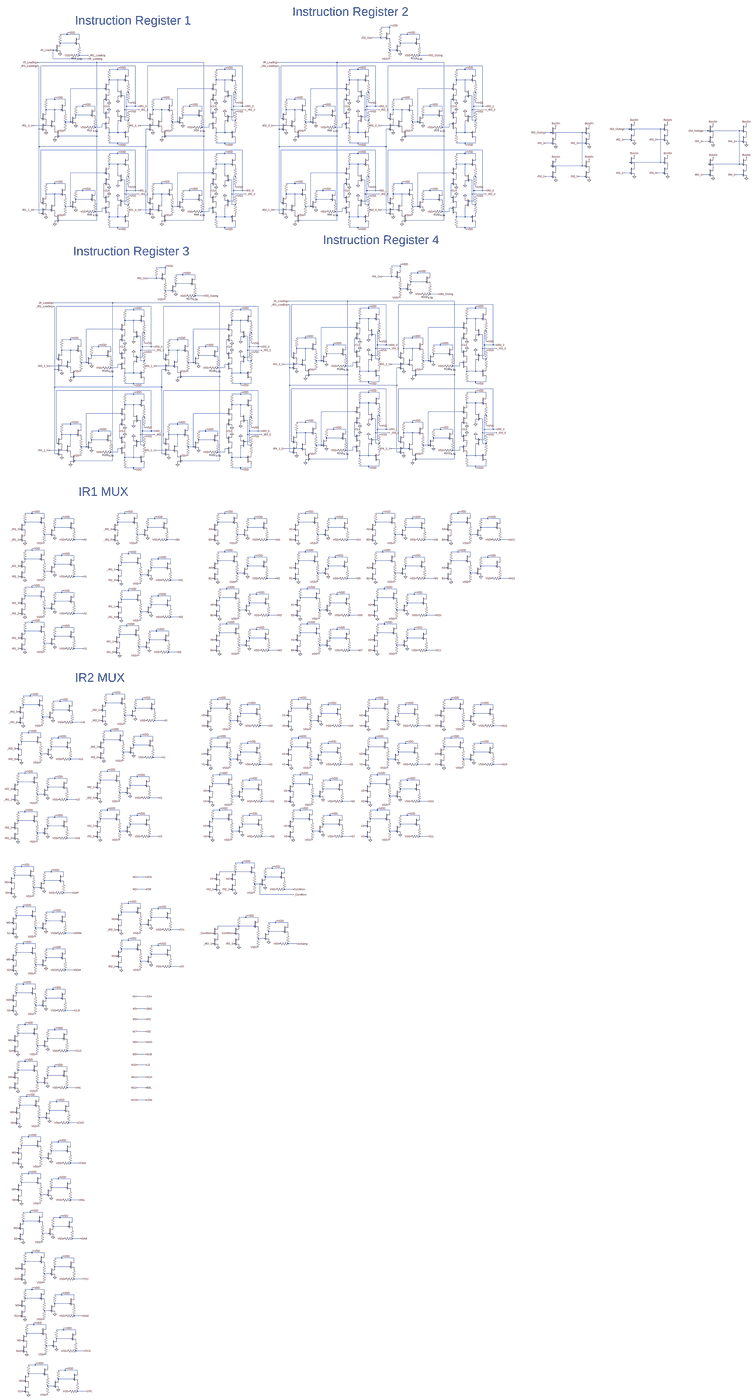
[diagram p0: schematic instruction_register.asc, whole sheet]
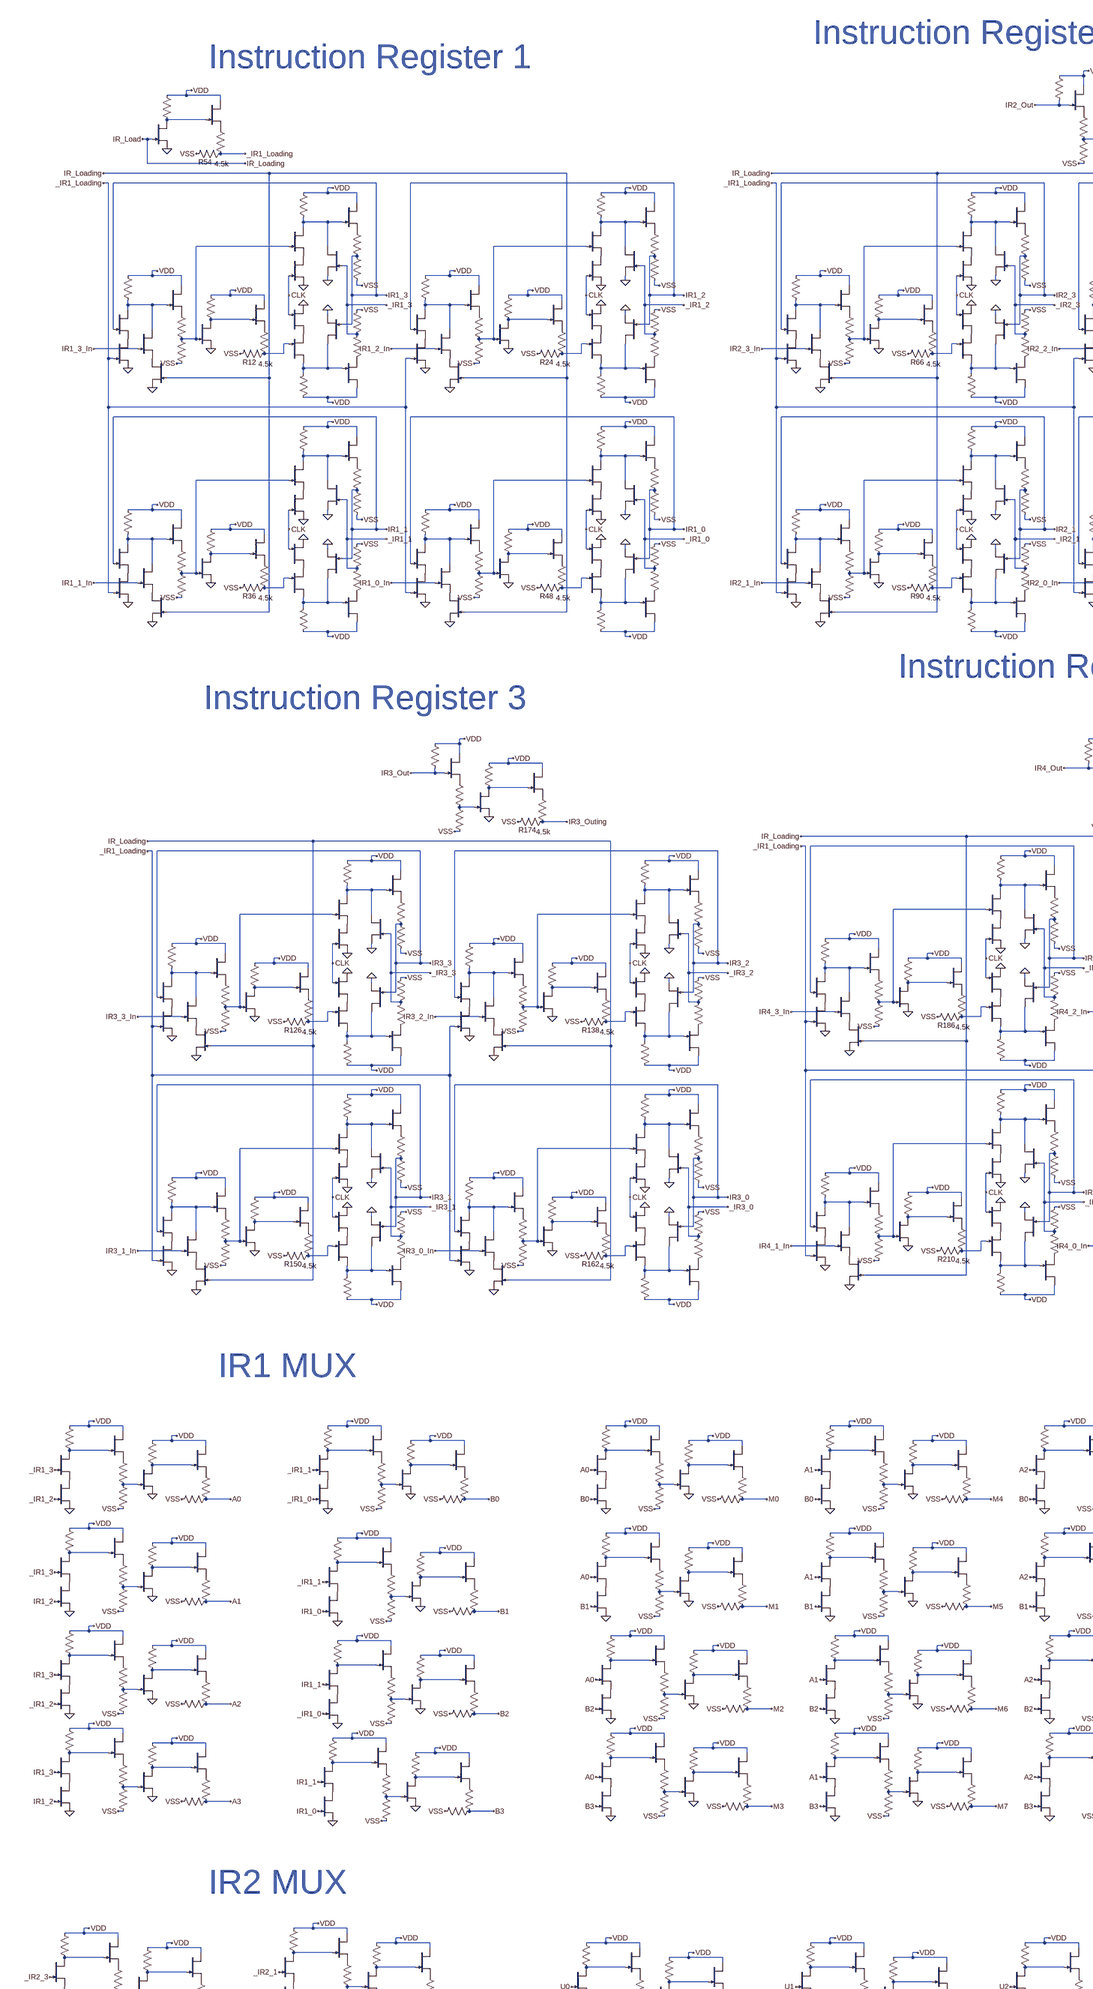
[diagram p1: schematic instruction_register.asc, part, row 1 of 2, column 1 of 2]
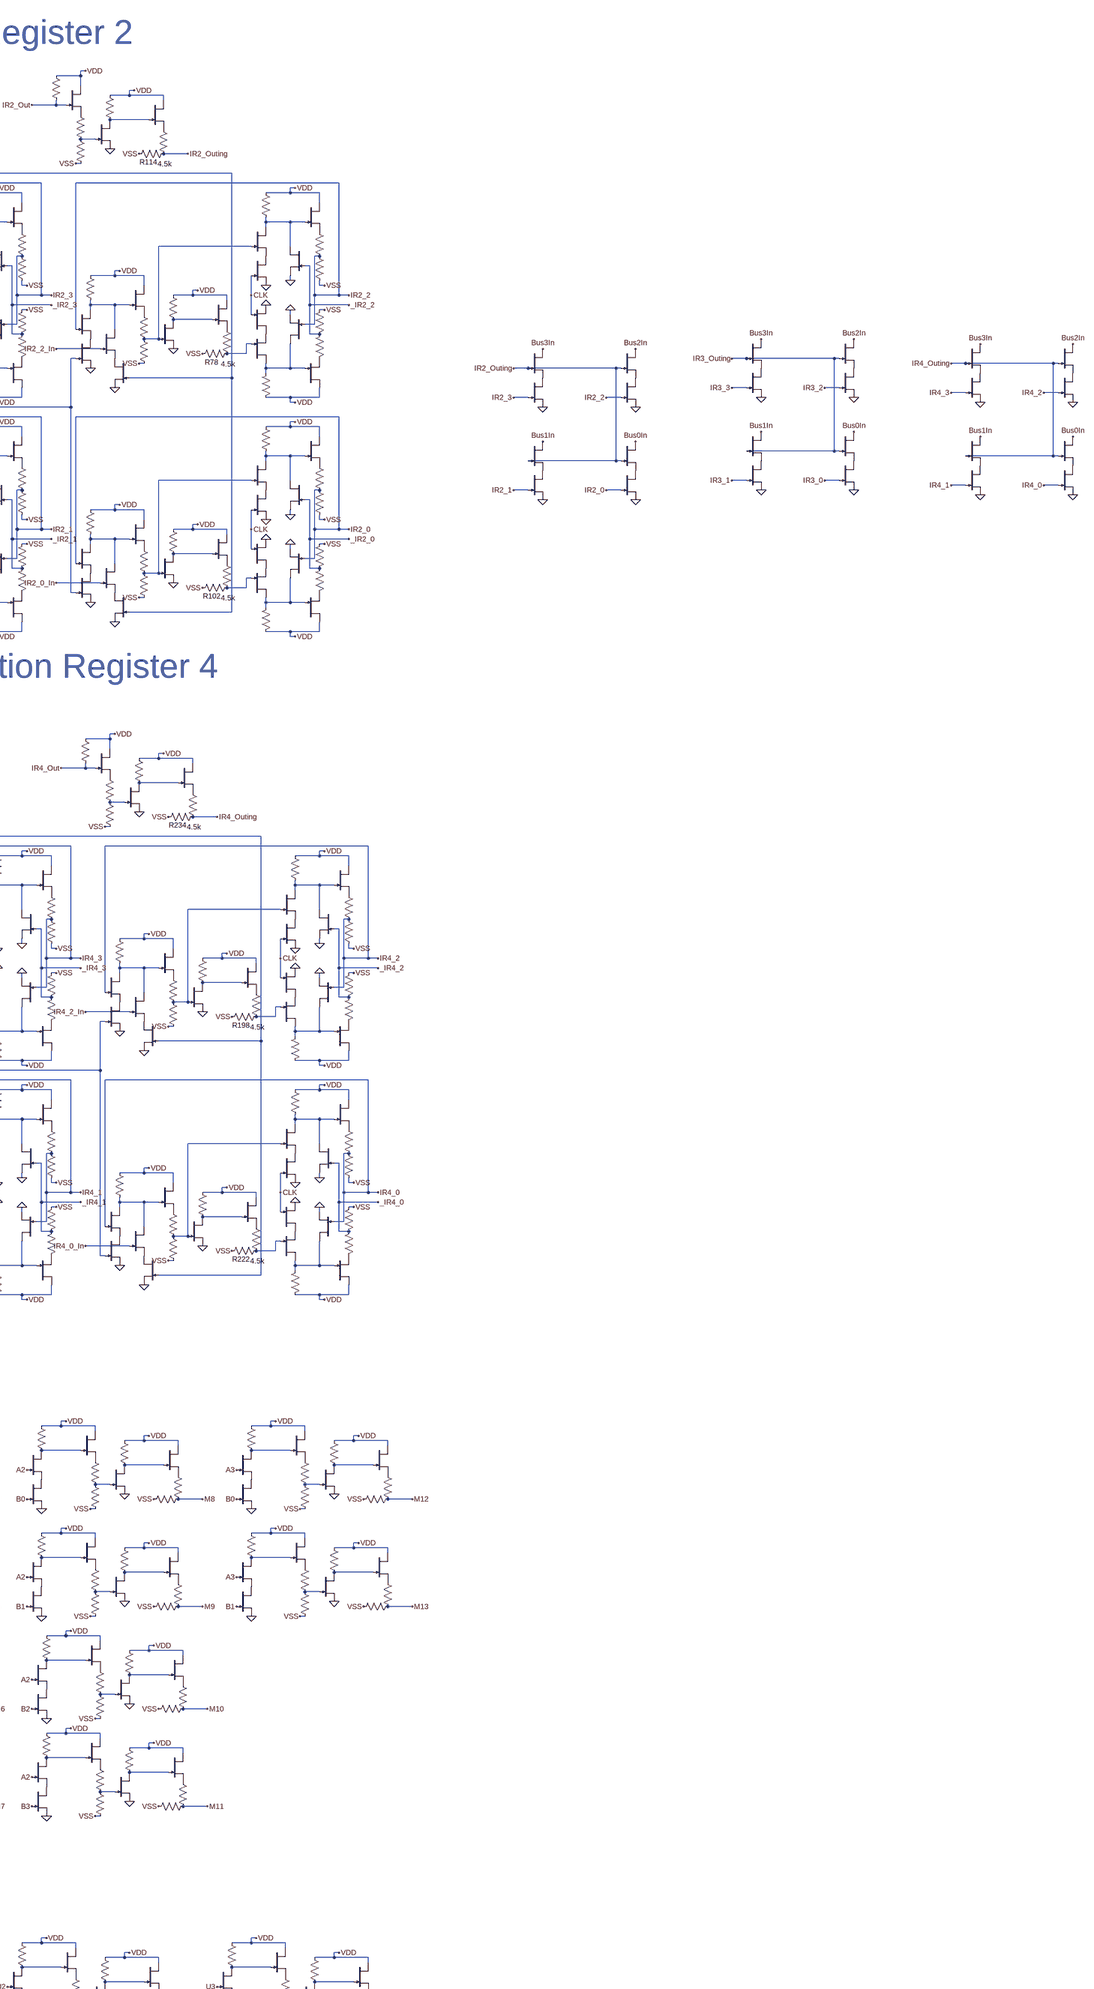
[diagram p2: schematic instruction_register.asc, part, row 1 of 2, column 2 of 2]
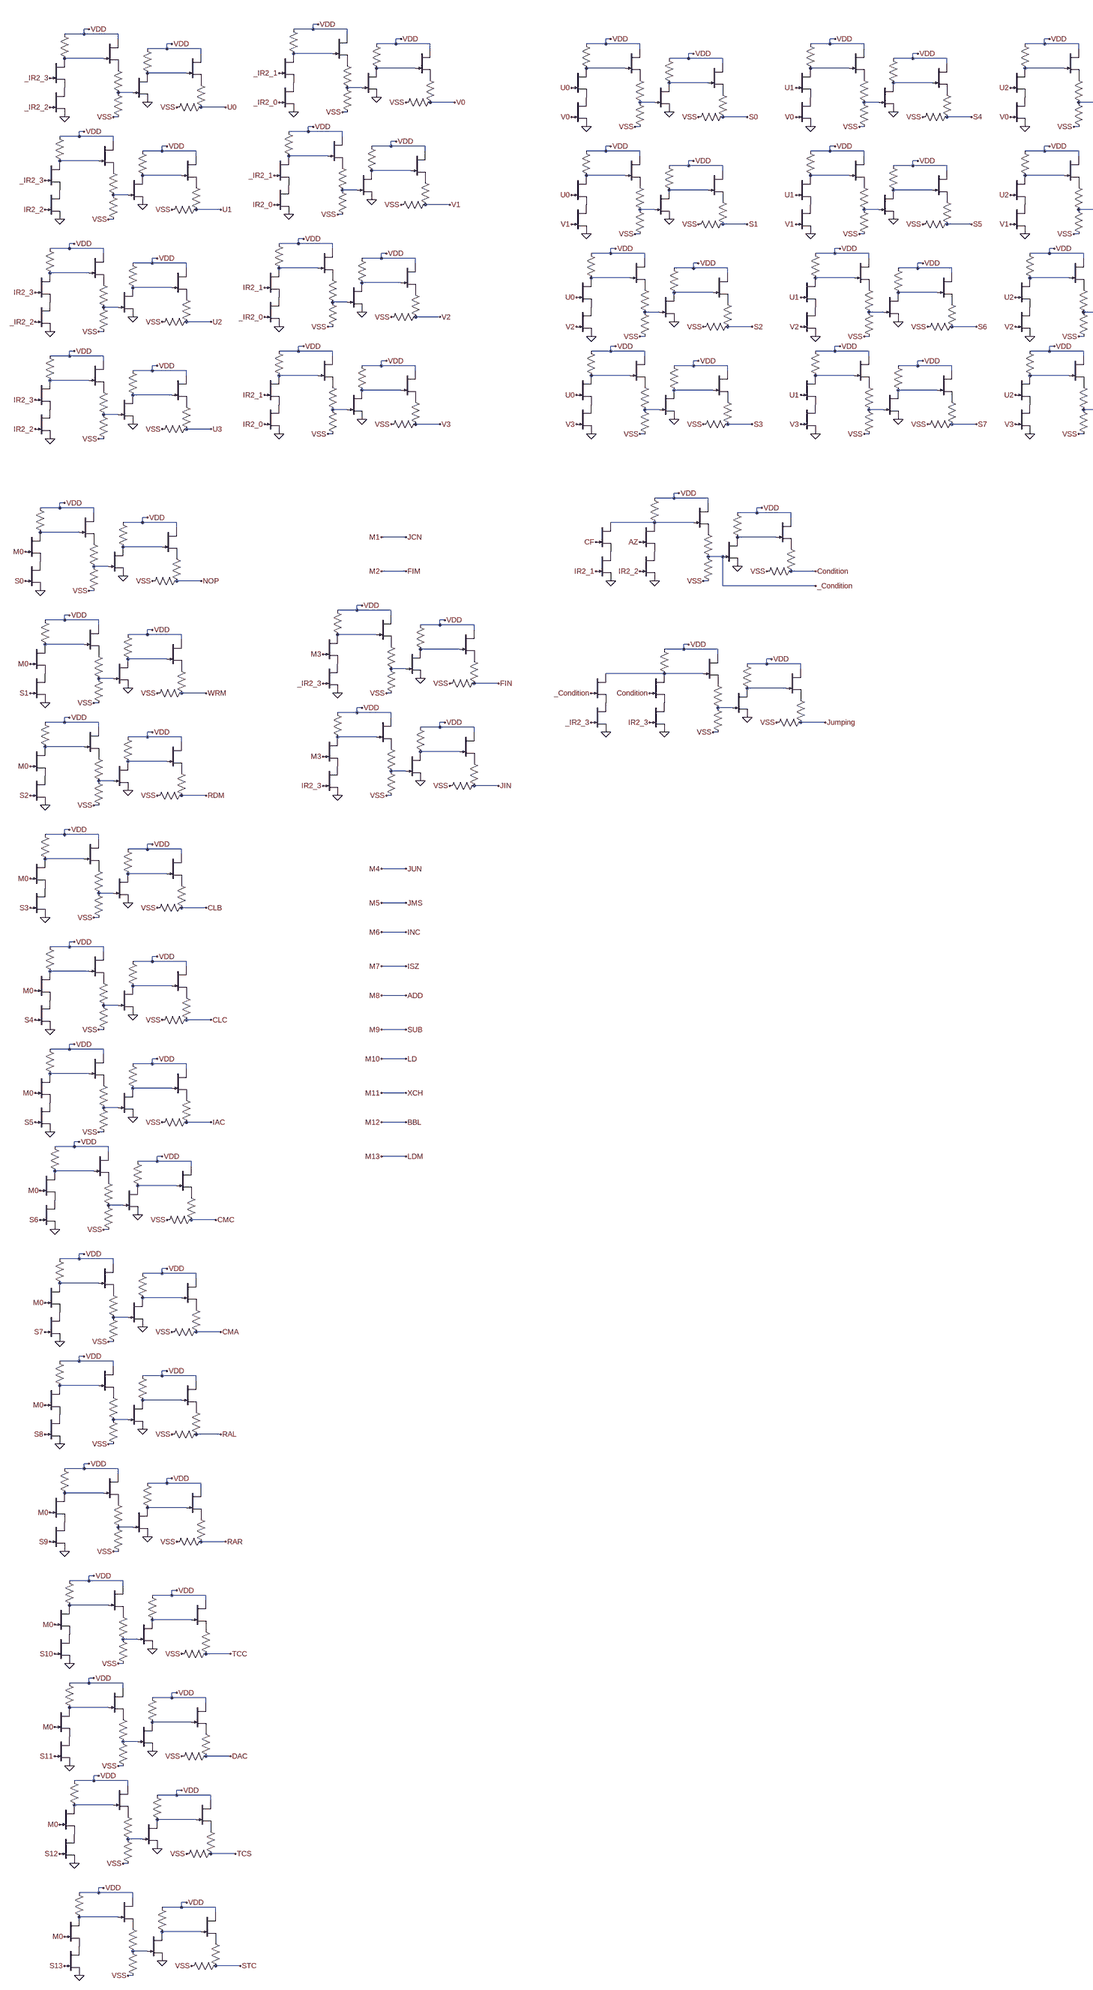
[diagram p3: schematic instruction_register.asc, part, row 2 of 2, column 1 of 2]
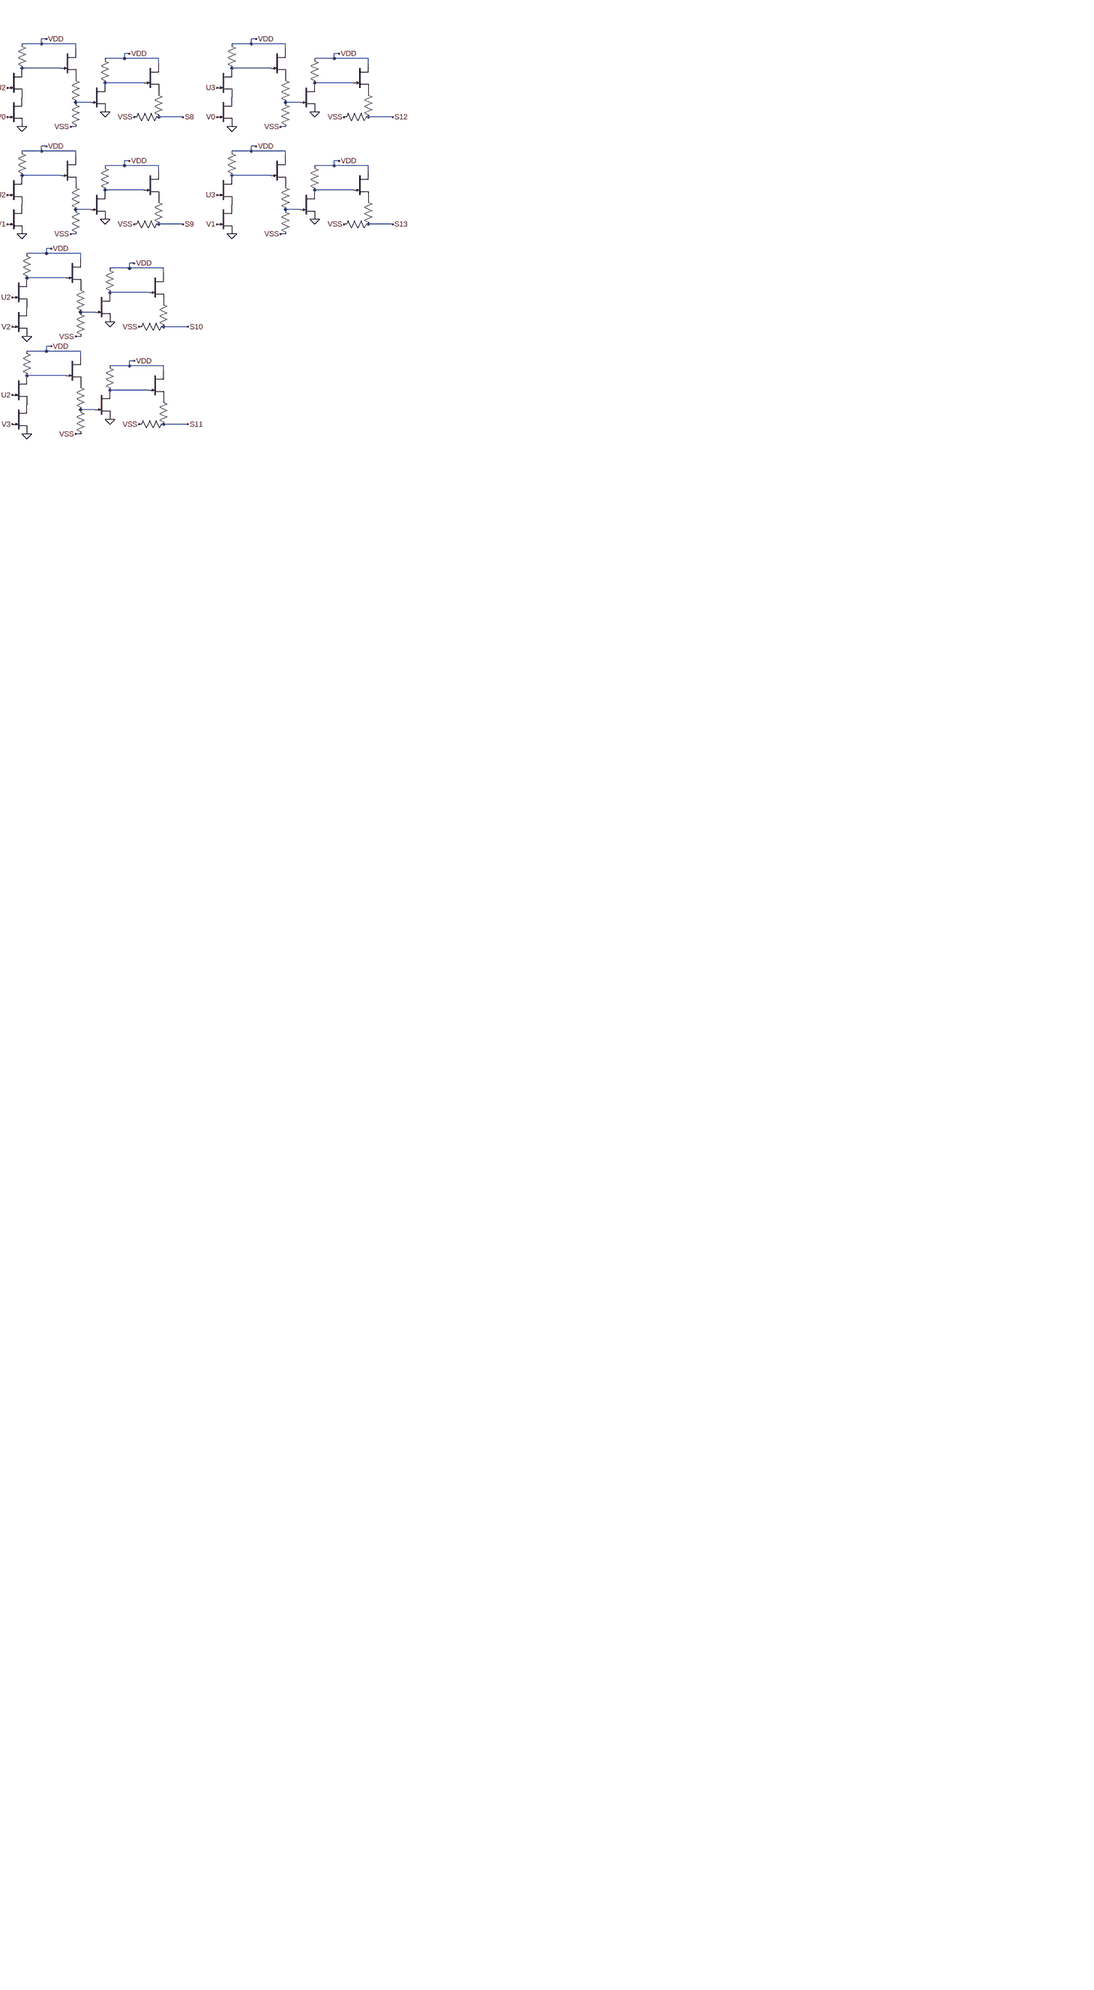
[diagram p4: schematic instruction_register.asc, part, row 2 of 2, column 2 of 2]
* instruction_register.asc
J_A1 P001 IR2_3 0 DR
J_A2 Bus3In IR2_Outing P001 DR
J_A3 P002 IR2_2 0 DR
J_A4 Bus2In IR2_Outing P002 DR
J_A5 P003 IR2_1 0 DR
J_A6 Bus1In IR2_Outing P003 DR
J_A7 P004 IR2_0 0 DR
J_A8 Bus0In IR2_Outing P004 DR
J_A9 P005 IR3_3 0 DR
J_A10 Bus3In IR3_Outing P005 DR
J_A11 P006 IR3_2 0 DR
J_A12 Bus2In IR3_Outing P006 DR
J_A13 P007 IR3_1 0 DR
J_A14 Bus1In IR3_Outing P007 DR
J_A15 P008 IR3_0 0 DR
J_A16 Bus0In IR3_Outing P008 DR
J_A17 P009 IR4_3 0 DR
J_A18 Bus3In IR4_Outing P009 DR
J_A19 P010 IR4_2 0 DR
J_A20 Bus2In IR4_Outing P010 DR
J_A21 P011 IR4_1 0 DR
J_A22 Bus1In IR4_Outing P011 DR
J_A23 P012 IR4_0 0 DR
J_A24 Bus0In IR4_Outing P012 DR
J_A25 N004 N008 P013 DR
R1 VDD N004 100k
J_F1 VDD N004 P014 DR
R2 P014 IR1_3 1k
R3 IR1_3 VSS 4.8k
J_B1 N004 _IR1_3 0 DR
J_A26 N024 N020 P015 DR
R4 VDD N024 100k
J_F2 VDD N024 P016 DR
R5 P016 _IR1_3 1k
R6 _IR1_3 VSS 4.8k
J_B2 N024 IR1_3 0 DR
J_A27 P013 CLK 0 DR
J_A28 P015 CLK 0 DR
J_A29 N012 IR1_3 P017 DR
R7 VDD N012 100k
J_F3 VDD N012 P018 DR
R8 P018 N008 1k
R9 N008 VSS 4.8k
J_B3 N012 IR1_3_In P019 DR
J_A30 N016 N008 0 DR
R10 VDD N016 50k
J_A31 VDD N016 P020 DR
R11 P020 N020 1k
R12 N020 VSS 4.5k
J_A32 P017 _IR1_Loading 0 DR
J_B4 P019 IR_Loading 0 DR
J_A33 N005 N009 P021 DR
R13 VDD N005 100k
J_F4 VDD N005 P022 DR
R14 P022 IR1_2 1k
R15 IR1_2 VSS 4.8k
J_B5 N005 _IR1_2 0 DR
J_A34 N025 N021 P023 DR
R16 VDD N025 100k
J_F5 VDD N025 P024 DR
R17 P024 _IR1_2 1k
R18 _IR1_2 VSS 4.8k
J_B6 N025 IR1_2 0 DR
J_A35 P021 CLK 0 DR
J_A36 P023 CLK 0 DR
J_A37 N013 IR1_2 P025 DR
R19 VDD N013 100k
J_F6 VDD N013 P026 DR
R20 P026 N009 1k
R21 N009 VSS 4.8k
J_B7 N013 IR1_2_In P027 DR
J_A38 N017 N009 0 DR
R22 VDD N017 50k
J_A39 VDD N017 P028 DR
R23 P028 N021 1k
R24 N021 VSS 4.5k
J_A40 P025 _IR1_Loading 0 DR
J_B8 P027 IR_Loading 0 DR
J_A41 N028 N032 P029 DR
R25 VDD N028 100k
J_F7 VDD N028 P030 DR
R26 P030 IR1_1 1k
R27 IR1_1 VSS 4.8k
J_B9 N028 _IR1_1 0 DR
J_A42 N048 N044 P031 DR
R28 VDD N048 100k
J_F8 VDD N048 P032 DR
R29 P032 _IR1_1 1k
R30 _IR1_1 VSS 4.8k
J_B10 N048 IR1_1 0 DR
J_A43 P029 CLK 0 DR
J_A44 P031 CLK 0 DR
J_A45 N036 IR1_1 P033 DR
R31 VDD N036 100k
J_F9 VDD N036 P034 DR
R32 P034 N032 1k
R33 N032 VSS 4.8k
J_B11 N036 IR1_1_In P035 DR
J_A46 N040 N032 0 DR
R34 VDD N040 50k
J_A47 VDD N040 P036 DR
R35 P036 N044 1k
R36 N044 VSS 4.5k
J_A48 P033 _IR1_Loading 0 DR
J_B12 P035 IR_Loading 0 DR
J_A49 N029 N033 P037 DR
R37 VDD N029 100k
J_F10 VDD N029 P038 DR
R38 P038 IR1_0 1k
R39 IR1_0 VSS 4.8k
J_B13 N029 _IR1_0 0 DR
J_A50 N049 N045 P039 DR
R40 VDD N049 100k
J_F11 VDD N049 P040 DR
R41 P040 _IR1_0 1k
R42 _IR1_0 VSS 4.8k
J_B14 N049 IR1_0 0 DR
J_A51 P037 CLK 0 DR
J_A52 P039 CLK 0 DR
J_A53 N037 IR1_0 P041 DR
R43 VDD N037 100k
J_F12 VDD N037 P042 DR
R44 P042 N033 1k
R45 N033 VSS 4.8k
J_B15 N037 IR1_0_In P043 DR
J_A54 N041 N033 0 DR
R46 VDD N041 50k
J_A55 VDD N041 P044 DR
R47 P044 N045 1k
R48 N045 VSS 4.5k
J_A56 P041 _IR1_Loading 0 DR
J_B16 P043 IR_Loading 0 DR
J_A57 N001 IR_Loading 0 DR
R52 VDD N001 50k
J_A58 VDD N001 P045 DR
R53 P045 _IR1_Loading 1k
R54 _IR1_Loading VSS 4.5k
J_A59 N006 N010 P046 DR
R55 VDD N006 100k
J_F14 VDD N006 P047 DR
R56 P047 IR2_3 1k
R57 IR2_3 VSS 4.8k
J_B17 N006 _IR2_3 0 DR
J_A60 N026 N022 P048 DR
R58 VDD N026 100k
J_F15 VDD N026 P049 DR
R59 P049 _IR2_3 1k
R60 _IR2_3 VSS 4.8k
J_B18 N026 IR2_3 0 DR
J_A61 P046 CLK 0 DR
J_A62 P048 CLK 0 DR
J_A63 N014 IR2_3 P050 DR
R61 VDD N014 100k
J_F16 VDD N014 P051 DR
R62 P051 N010 1k
R63 N010 VSS 4.8k
J_B19 N014 IR2_3_In P052 DR
J_A64 N018 N010 0 DR
R64 VDD N018 50k
J_A65 VDD N018 P053 DR
R65 P053 N022 1k
R66 N022 VSS 4.5k
J_A66 P050 _IR1_Loading 0 DR
J_B20 P052 IR_Loading 0 DR
J_A67 N007 N011 P054 DR
R67 VDD N007 100k
J_F17 VDD N007 P055 DR
R68 P055 IR2_2 1k
R69 IR2_2 VSS 4.8k
J_B21 N007 _IR2_2 0 DR
J_A68 N027 N023 P056 DR
R70 VDD N027 100k
J_F18 VDD N027 P057 DR
R71 P057 _IR2_2 1k
R72 _IR2_2 VSS 4.8k
J_B22 N027 IR2_2 0 DR
J_A69 P054 CLK 0 DR
J_A70 P056 CLK 0 DR
J_A71 N015 IR2_2 P058 DR
R73 VDD N015 100k
J_F19 VDD N015 P059 DR
R74 P059 N011 1k
R75 N011 VSS 4.8k
J_B23 N015 IR2_2_In P060 DR
J_A72 N019 N011 0 DR
R76 VDD N019 50k
J_A73 VDD N019 P061 DR
R77 P061 N023 1k
R78 N023 VSS 4.5k
J_A74 P058 _IR1_Loading 0 DR
J_B24 P060 IR_Loading 0 DR
J_A75 N030 N034 P062 DR
R79 VDD N030 100k
J_F20 VDD N030 P063 DR
R80 P063 IR2_1 1k
R81 IR2_1 VSS 4.8k
J_B25 N030 _IR2_1 0 DR
J_A76 N050 N046 P064 DR
R82 VDD N050 100k
J_F21 VDD N050 P065 DR
R83 P065 _IR2_1 1k
R84 _IR2_1 VSS 4.8k
J_B26 N050 IR2_1 0 DR
J_A77 P062 CLK 0 DR
J_A78 P064 CLK 0 DR
J_A79 N038 IR2_1 P066 DR
R85 VDD N038 100k
J_F22 VDD N038 P067 DR
R86 P067 N034 1k
R87 N034 VSS 4.8k
J_B27 N038 IR2_1_In P068 DR
J_A80 N042 N034 0 DR
R88 VDD N042 50k
J_A81 VDD N042 P069 DR
R89 P069 N046 1k
R90 N046 VSS 4.5k
J_A82 P066 _IR1_Loading 0 DR
J_B28 P068 IR_Loading 0 DR
J_A83 N031 N035 P070 DR
R91 VDD N031 100k
J_F23 VDD N031 P071 DR
R92 P071 IR2_0 1k
R93 IR2_0 VSS 4.8k
J_B29 N031 _IR2_0 0 DR
J_A84 N051 N047 P072 DR
R94 VDD N051 100k
J_F24 VDD N051 P073 DR
R95 P073 _IR2_0 1k
R96 _IR2_0 VSS 4.8k
J_B30 N051 IR2_0 0 DR
J_A85 P070 CLK 0 DR
J_A86 P072 CLK 0 DR
J_A87 N039 IR2_0 P074 DR
R97 VDD N039 100k
J_F25 VDD N039 P075 DR
R98 P075 N035 1k
R99 N035 VSS 4.8k
J_B31 N039 IR2_0_In P076 DR
J_A88 N043 N035 0 DR
R100 VDD N043 50k
J_A89 VDD N043 P077 DR
R101 P077 N047 1k
R102 N047 VSS 4.5k
J_A90 P074 _IR1_Loading 0 DR
J_B32 P076 IR_Loading 0 DR
R109 VDD IR2_Out 100k
J_F27 VDD IR2_Out P078 DR
R110 P078 N003 1k
R111 N003 VSS 4.8k
J_A93 N002 N003 0 DR
R112 VDD N002 50k
J_A94 VDD N002 P079 DR
R113 P079 IR2_Outing 1k
R114 IR2_Outing VSS 4.5k
J_A95 N058 N062 P080 DR
R115 VDD N058 100k
J_F28 VDD N058 P081 DR
R116 P081 IR3_3 1k
R117 IR3_3 VSS 4.8k
J_B33 N058 _IR3_3 0 DR
J_A96 N078 N074 P082 DR
R118 VDD N078 100k
J_F29 VDD N078 P083 DR
R119 P083 _IR3_3 1k
R120 _IR3_3 VSS 4.8k
J_B34 N078 IR3_3 0 DR
J_A97 P080 CLK 0 DR
J_A98 P082 CLK 0 DR
J_A99 N066 IR3_3 P084 DR
R121 VDD N066 100k
J_F30 VDD N066 P085 DR
R122 P085 N062 1k
R123 N062 VSS 4.8k
J_B35 N066 IR3_3_In P086 DR
J_A100 N070 N062 0 DR
R124 VDD N070 50k
J_A101 VDD N070 P087 DR
R125 P087 N074 1k
R126 N074 VSS 4.5k
J_A102 P084 _IR1_Loading 0 DR
J_B36 P086 IR_Loading 0 DR
J_A103 N059 N063 P088 DR
R127 VDD N059 100k
J_F31 VDD N059 P089 DR
R128 P089 IR3_2 1k
R129 IR3_2 VSS 4.8k
J_B37 N059 _IR3_2 0 DR
J_A104 N079 N075 P090 DR
R130 VDD N079 100k
J_F32 VDD N079 P091 DR
R131 P091 _IR3_2 1k
R132 _IR3_2 VSS 4.8k
J_B38 N079 IR3_2 0 DR
J_A105 P088 CLK 0 DR
J_A106 P090 CLK 0 DR
J_A107 N067 IR3_2 P092 DR
R133 VDD N067 100k
J_F33 VDD N067 P093 DR
R134 P093 N063 1k
R135 N063 VSS 4.8k
J_B39 N067 IR3_2_In P094 DR
J_A108 N071 N063 0 DR
R136 VDD N071 50k
J_A109 VDD N071 P095 DR
R137 P095 N075 1k
R138 N075 VSS 4.5k
J_A110 P092 _IR1_Loading 0 DR
J_B40 P094 IR_Loading 0 DR
J_A111 N082 N086 P096 DR
R139 VDD N082 100k
J_F34 VDD N082 P097 DR
R140 P097 IR3_1 1k
R141 IR3_1 VSS 4.8k
J_B41 N082 _IR3_1 0 DR
J_A112 N102 N098 P098 DR
R142 VDD N102 100k
J_F35 VDD N102 P099 DR
R143 P099 _IR3_1 1k
R144 _IR3_1 VSS 4.8k
J_B42 N102 IR3_1 0 DR
J_A113 P096 CLK 0 DR
J_A114 P098 CLK 0 DR
J_A115 N090 IR3_1 P100 DR
R145 VDD N090 100k
J_F36 VDD N090 P101 DR
R146 P101 N086 1k
R147 N086 VSS 4.8k
J_B43 N090 IR3_1_In P102 DR
J_A116 N094 N086 0 DR
R148 VDD N094 50k
J_A117 VDD N094 P103 DR
R149 P103 N098 1k
R150 N098 VSS 4.5k
J_A118 P100 _IR1_Loading 0 DR
J_B44 P102 IR_Loading 0 DR
J_A119 N083 N087 P104 DR
R151 VDD N083 100k
J_F37 VDD N083 P105 DR
R152 P105 IR3_0 1k
R153 IR3_0 VSS 4.8k
J_B45 N083 _IR3_0 0 DR
J_A120 N103 N099 P106 DR
R154 VDD N103 100k
J_F38 VDD N103 P107 DR
R155 P107 _IR3_0 1k
R156 _IR3_0 VSS 4.8k
J_B46 N103 IR3_0 0 DR
J_A121 P104 CLK 0 DR
J_A122 P106 CLK 0 DR
J_A123 N091 IR3_0 P108 DR
R157 VDD N091 100k
J_F39 VDD N091 P109 DR
R158 P109 N087 1k
R159 N087 VSS 4.8k
J_B47 N091 IR3_0_In P110 DR
J_A124 N095 N087 0 DR
R160 VDD N095 50k
J_A125 VDD N095 P111 DR
R161 P111 N099 1k
R162 N099 VSS 4.5k
J_A126 P108 _IR1_Loading 0 DR
J_B48 P110 IR_Loading 0 DR
R169 VDD IR3_Out 100k
J_F41 VDD IR3_Out P112 DR
R170 P112 N055 1k
R171 N055 VSS 4.8k
J_A129 N053 N055 0 DR
R172 VDD N053 50k
J_A130 VDD N053 P113 DR
R173 P113 IR3_Outing 1k
R174 IR3_Outing VSS 4.5k
J_A131 N056 N060 P114 DR
R175 VDD N056 100k
J_F42 VDD N056 P115 DR
R176 P115 IR4_3 1k
R177 IR4_3 VSS 4.8k
J_B49 N056 _IR4_3 0 DR
J_A132 N076 N072 P116 DR
R178 VDD N076 100k
J_F43 VDD N076 P117 DR
R179 P117 _IR4_3 1k
R180 _IR4_3 VSS 4.8k
J_B50 N076 IR4_3 0 DR
J_A133 P114 CLK 0 DR
J_A134 P116 CLK 0 DR
J_A135 N064 IR4_3 P118 DR
R181 VDD N064 100k
J_F44 VDD N064 P119 DR
R182 P119 N060 1k
R183 N060 VSS 4.8k
J_B51 N064 IR4_3_In P120 DR
J_A136 N068 N060 0 DR
R184 VDD N068 50k
J_A137 VDD N068 P121 DR
R185 P121 N072 1k
R186 N072 VSS 4.5k
J_A138 P118 _IR1_Loading 0 DR
J_B52 P120 IR_Loading 0 DR
J_A139 N057 N061 P122 DR
R187 VDD N057 100k
J_F45 VDD N057 P123 DR
R188 P123 IR4_2 1k
R189 IR4_2 VSS 4.8k
J_B53 N057 _IR4_2 0 DR
J_A140 N077 N073 P124 DR
R190 VDD N077 100k
J_F46 VDD N077 P125 DR
R191 P125 _IR4_2 1k
R192 _IR4_2 VSS 4.8k
J_B54 N077 IR4_2 0 DR
J_A141 P122 CLK 0 DR
J_A142 P124 CLK 0 DR
J_A143 N065 IR4_2 P126 DR
R193 VDD N065 100k
J_F47 VDD N065 P127 DR
R194 P127 N061 1k
R195 N061 VSS 4.8k
J_B55 N065 IR4_2_In P128 DR
J_A144 N069 N061 0 DR
R196 VDD N069 50k
J_A145 VDD N069 P129 DR
R197 P129 N073 1k
R198 N073 VSS 4.5k
J_A146 P126 _IR1_Loading 0 DR
J_B56 P128 IR_Loading 0 DR
J_A147 N080 N084 P130 DR
R199 VDD N080 100k
J_F48 VDD N080 P131 DR
R200 P131 IR4_1 1k
R201 IR4_1 VSS 4.8k
J_B57 N080 _IR4_1 0 DR
J_A148 N100 N096 P132 DR
R202 VDD N100 100k
J_F49 VDD N100 P133 DR
R203 P133 _IR4_1 1k
R204 _IR4_1 VSS 4.8k
J_B58 N100 IR4_1 0 DR
J_A149 P130 CLK 0 DR
J_A150 P132 CLK 0 DR
J_A151 N088 IR4_1 P134 DR
R205 VDD N088 100k
J_F50 VDD N088 P135 DR
R206 P135 N084 1k
R207 N084 VSS 4.8k
J_B59 N088 IR4_1_In P136 DR
J_A152 N092 N084 0 DR
R208 VDD N092 50k
J_A153 VDD N092 P137 DR
R209 P137 N096 1k
R210 N096 VSS 4.5k
J_A154 P134 _IR1_Loading 0 DR
J_B60 P136 IR_Loading 0 DR
J_A155 N081 N085 P138 DR
R211 VDD N081 100k
J_F51 VDD N081 P139 DR
R212 P139 IR4_0 1k
R213 IR4_0 VSS 4.8k
J_B61 N081 _IR4_0 0 DR
J_A156 N101 N097 P140 DR
R214 VDD N101 100k
J_F52 VDD N101 P141 DR
R215 P141 _IR4_0 1k
R216 _IR4_0 VSS 4.8k
J_B62 N101 IR4_0 0 DR
J_A157 P138 CLK 0 DR
J_A158 P140 CLK 0 DR
J_A159 N089 IR4_0 P142 DR
R217 VDD N089 100k
J_F53 VDD N089 P143 DR
R218 P143 N085 1k
R219 N085 VSS 4.8k
J_B63 N089 IR4_0_In P144 DR
J_A160 N093 N085 0 DR
R220 VDD N093 50k
J_A161 VDD N093 P145 DR
R221 P145 N097 1k
R222 N097 VSS 4.5k
J_A162 P142 _IR1_Loading 0 DR
J_B64 P144 IR_Loading 0 DR
R229 VDD IR4_Out 100k
J_F55 VDD IR4_Out P146 DR
R230 P146 N054 1k
R231 N054 VSS 4.8k
J_A165 N052 N054 0 DR
R232 VDD N052 50k
J_A166 VDD N052 P147 DR
R233 P147 IR4_Outing 1k
R234 IR4_Outing VSS 4.5k
J_A1920 N104 _IR1_3 P148 DR
R2998 VDD N104 100k
J_F734 VDD N104 P149 DR
R2999 P149 N116 1k
R3000 N116 VSS 4.8k
J_B906 P148 _IR1_2 0 DR
J_A1921 N110 N116 0 DR
R3001 VDD N110 50k
J_F735 VDD N110 P150 DR
R3002 P150 A0 1k
R3003 A0 VSS 4.5k
J_A1928 N105 _IR1_1 P151 DR
R3022 VDD N105 100k
J_F742 VDD N105 P152 DR
R3023 P152 N117 1k
R3024 N117 VSS 4.8k
J_B910 P151 _IR1_0 0 DR
J_A1929 N111 N117 0 DR
R3025 VDD N111 50k
J_F743 VDD N111 P153 DR
R3026 P153 B0 1k
R3027 B0 VSS 4.5k
J_A91 N122 _IR1_3 P154 DR
R103 VDD N122 100k
J_F26 VDD N122 P155 DR
R104 P155 N134 1k
R105 N134 VSS 4.8k
J_B65 P154 IR1_2 0 DR
J_A92 N128 N134 0 DR
R106 VDD N128 50k
J_F40 VDD N128 P156 DR
R107 P156 A1 1k
R108 A1 VSS 4.5k
J_A127 N140 IR1_3 P157 DR
R163 VDD N140 100k
J_F54 VDD N140 P158 DR
R164 P158 N150 1k
R165 N150 VSS 4.8k
J_B66 P157 _IR1_2 0 DR
J_A128 N145 N150 0 DR
R166 VDD N145 50k
J_F56 VDD N145 P159 DR
R167 P159 A2 1k
R168 A2 VSS 4.5k
J_A163 N155 IR1_3 P160 DR
R223 VDD N155 100k
J_F57 VDD N155 P161 DR
R224 P161 N165 1k
R225 N165 VSS 4.8k
J_B67 P160 IR1_2 0 DR
J_A164 N160 N165 0 DR
R226 VDD N160 50k
J_F58 VDD N160 P162 DR
R227 P162 A3 1k
R228 A3 VSS 4.5k
J_A167 N127 _IR1_1 P163 DR
R235 VDD N127 100k
J_F59 VDD N127 P164 DR
R236 P164 N139 1k
R237 N139 VSS 4.8k
J_B68 P163 IR1_0 0 DR
J_A168 N133 N139 0 DR
R238 VDD N133 50k
J_F60 VDD N133 P165 DR
R239 P165 B1 1k
R240 B1 VSS 4.5k
J_A169 N144 IR1_1 P166 DR
R241 VDD N144 100k
J_F61 VDD N144 P167 DR
R242 P167 N154 1k
R243 N154 VSS 4.8k
J_B69 P166 _IR1_0 0 DR
J_A170 N149 N154 0 DR
R244 VDD N149 50k
J_F62 VDD N149 P168 DR
R245 P168 B2 1k
R246 B2 VSS 4.5k
J_A171 N159 IR1_1 P169 DR
R247 VDD N159 100k
J_F63 VDD N159 P170 DR
R248 P170 N169 1k
R249 N169 VSS 4.8k
J_B70 P169 IR1_0 0 DR
J_A172 N164 N169 0 DR
R250 VDD N164 50k
J_F64 VDD N164 P171 DR
R251 P171 B3 1k
R252 B3 VSS 4.5k
J_A173 N106 A0 P172 DR
R253 VDD N106 100k
J_F65 VDD N106 P173 DR
R254 P173 N118 1k
R255 N118 VSS 4.8k
J_B71 P172 B0 0 DR
J_A174 N112 N118 0 DR
R256 VDD N112 50k
J_F66 VDD N112 P174 DR
R257 P174 M0 1k
R258 M0 VSS 4.5k
J_A175 N123 A0 P175 DR
R259 VDD N123 100k
J_F67 VDD N123 P176 DR
R260 P176 N135 1k
R261 N135 VSS 4.8k
J_B72 P175 B1 0 DR
J_A176 N129 N135 0 DR
R262 VDD N129 50k
J_F68 VDD N129 P177 DR
R263 P177 JCN 1k
R264 JCN VSS 4.5k
J_A177 N141 A0 P178 DR
R265 VDD N141 100k
J_F69 VDD N141 P179 DR
R266 P179 N151 1k
R267 N151 VSS 4.8k
J_B73 P178 B2 0 DR
J_A178 N146 N151 0 DR
R268 VDD N146 50k
J_F70 VDD N146 P180 DR
R269 P180 FIM 1k
R270 FIM VSS 4.5k
J_A179 N156 A0 P181 DR
R271 VDD N156 100k
J_F71 VDD N156 P182 DR
R272 P182 N166 1k
R273 N166 VSS 4.8k
J_B74 P181 B3 0 DR
J_A180 N161 N166 0 DR
R274 VDD N161 50k
J_F72 VDD N161 P183 DR
R275 P183 M3 1k
R276 M3 VSS 4.5k
J_A181 N107 A1 P184 DR
R277 VDD N107 100k
J_F73 VDD N107 P185 DR
R278 P185 N119 1k
R279 N119 VSS 4.8k
J_B75 P184 B0 0 DR
J_A182 N113 N119 0 DR
R280 VDD N113 50k
J_F74 VDD N113 P186 DR
R281 P186 JUN 1k
R282 JUN VSS 4.5k
J_A183 N124 A1 P187 DR
R283 VDD N124 100k
J_F75 VDD N124 P188 DR
R284 P188 N136 1k
R285 N136 VSS 4.8k
J_B76 P187 B1 0 DR
J_A184 N130 N136 0 DR
R286 VDD N130 50k
J_F76 VDD N130 P189 DR
R287 P189 JMS 1k
R288 JMS VSS 4.5k
J_A185 N142 A1 P190 DR
R289 VDD N142 100k
J_F77 VDD N142 P191 DR
R290 P191 N152 1k
R291 N152 VSS 4.8k
J_B77 P190 B2 0 DR
J_A186 N147 N152 0 DR
R292 VDD N147 50k
J_F78 VDD N147 P192 DR
R293 P192 INC 1k
R294 INC VSS 4.5k
J_A187 N157 A1 P193 DR
R295 VDD N157 100k
J_F79 VDD N157 P194 DR
R296 P194 N167 1k
R297 N167 VSS 4.8k
J_B78 P193 B3 0 DR
J_A188 N162 N167 0 DR
R298 VDD N162 50k
J_F80 VDD N162 P195 DR
R299 P195 ISZ 1k
R300 ISZ VSS 4.5k
J_A189 N108 A2 P196 DR
R301 VDD N108 100k
J_F81 VDD N108 P197 DR
R302 P197 N120 1k
R303 N120 VSS 4.8k
J_B79 P196 B0 0 DR
J_A190 N114 N120 0 DR
R304 VDD N114 50k
J_F82 VDD N114 P198 DR
R305 P198 ADD 1k
R306 ADD VSS 4.5k
J_A191 N125 A2 P199 DR
R307 VDD N125 100k
J_F83 VDD N125 P200 DR
R308 P200 N137 1k
R309 N137 VSS 4.8k
J_B80 P199 B1 0 DR
J_A192 N131 N137 0 DR
R310 VDD N131 50k
J_F84 VDD N131 P201 DR
R311 P201 SUB 1k
R312 SUB VSS 4.5k
J_A193 N143 A2 P202 DR
R313 VDD N143 100k
J_F85 VDD N143 P203 DR
R314 P203 N153 1k
R315 N153 VSS 4.8k
J_B81 P202 B2 0 DR
J_A194 N148 N153 0 DR
R316 VDD N148 50k
J_F86 VDD N148 P204 DR
R317 P204 LD 1k
R318 LD VSS 4.5k
J_A195 N158 A2 P205 DR
R319 VDD N158 100k
J_F87 VDD N158 P206 DR
R320 P206 N168 1k
R321 N168 VSS 4.8k
J_B82 P205 B3 0 DR
J_A196 N163 N168 0 DR
R322 VDD N163 50k
J_F88 VDD N163 P207 DR
R323 P207 XCH 1k
R324 XCH VSS 4.5k
J_A197 N109 A3 P208 DR
R325 VDD N109 100k
J_F89 VDD N109 P209 DR
R326 P209 N121 1k
R327 N121 VSS 4.8k
J_B83 P208 B0 0 DR
J_A198 N115 N121 0 DR
R328 VDD N115 50k
J_F90 VDD N115 P210 DR
R329 P210 BBL 1k
R330 BBL VSS 4.5k
J_A199 N126 A3 P211 DR
R331 VDD N126 100k
J_F91 VDD N126 P212 DR
R332 P212 N138 1k
R333 N138 VSS 4.8k
J_B84 P211 B1 0 DR
J_A200 N132 N138 0 DR
R334 VDD N132 50k
J_F92 VDD N132 P213 DR
R335 P213 LDM 1k
R336 LDM VSS 4.5k
J_A201 N171 _IR2_3 P214 DR
R337 VDD N171 100k
J_F93 VDD N171 P215 DR
R338 P215 N183 1k
R339 N183 VSS 4.8k
J_B85 P214 _IR2_2 0 DR
J_A202 N177 N183 0 DR
R340 VDD N177 50k
J_F94 VDD N177 P216 DR
R341 P216 U0 1k
R342 U0 VSS 4.5k
J_A203 N189 _IR2_3 P217 DR
R343 VDD N189 100k
J_F95 VDD N189 P218 DR
R344 P218 N201 1k
R345 N201 VSS 4.8k
J_B86 P217 IR2_2 0 DR
J_A204 N191 N201 0 DR
R346 VDD N191 50k
J_F96 VDD N191 P219 DR
R347 P219 U1 1k
R348 U1 VSS 4.5k
J_A205 N207 IR2_3 P220 DR
R349 VDD N207 100k
J_F97 VDD N207 P221 DR
R350 P221 N217 1k
R351 N217 VSS 4.8k
J_B87 P220 _IR2_2 0 DR
J_A206 N212 N217 0 DR
R352 VDD N212 50k
J_F98 VDD N212 P222 DR
R353 P222 U2 1k
R354 U2 VSS 4.5k
J_A207 N225 IR2_3 P223 DR
R355 VDD N225 100k
J_F99 VDD N225 P224 DR
R356 P224 N235 1k
R357 N235 VSS 4.8k
J_B88 P223 IR2_2 0 DR
J_A208 N230 N235 0 DR
R358 VDD N230 50k
J_F100 VDD N230 P225 DR
R359 P225 U3 1k
R360 U3 VSS 4.5k
J_A209 N170 _IR2_1 P226 DR
R361 VDD N170 100k
J_F101 VDD N170 P227 DR
R362 P227 N182 1k
R363 N182 VSS 4.8k
J_B89 P226 _IR2_0 0 DR
J_A210 N172 N182 0 DR
R364 VDD N172 50k
J_F102 VDD N172 P228 DR
R365 P228 V0 1k
R366 V0 VSS 4.5k
J_A211 N188 _IR2_1 P229 DR
R367 VDD N188 100k
J_F103 VDD N188 P230 DR
R368 P230 N196 1k
R369 N196 VSS 4.8k
J_B90 P229 IR2_0 0 DR
J_A212 N190 N196 0 DR
R370 VDD N190 50k
J_F104 VDD N190 P231 DR
R371 P231 V1 1k
R372 V1 VSS 4.5k
J_A213 N206 IR2_1 P232 DR
R373 VDD N206 100k
J_F105 VDD N206 P233 DR
R374 P233 N216 1k
R375 N216 VSS 4.8k
J_B91 P232 _IR2_0 0 DR
J_A214 N211 N216 0 DR
R376 VDD N211 50k
J_F106 VDD N211 P234 DR
R377 P234 V2 1k
R378 V2 VSS 4.5k
J_A215 N221 IR2_1 P235 DR
R379 VDD N221 100k
J_F107 VDD N221 P236 DR
R380 P236 N231 1k
R381 N231 VSS 4.8k
J_B92 P235 IR2_0 0 DR
J_A216 N226 N231 0 DR
R382 VDD N226 50k
J_F108 VDD N226 P237 DR
R383 P237 V3 1k
R384 V3 VSS 4.5k
J_A217 N173 U0 P238 DR
R385 VDD N173 100k
J_F109 VDD N173 P239 DR
R386 P239 N184 1k
R387 N184 VSS 4.8k
J_B93 P238 V0 0 DR
J_A218 N178 N184 0 DR
R388 VDD N178 50k
J_F110 VDD N178 P240 DR
R389 P240 S0 1k
R390 S0 VSS 4.5k
J_A219 N192 U0 P241 DR
R391 VDD N192 100k
J_F111 VDD N192 P242 DR
R392 P242 N202 1k
R393 N202 VSS 4.8k
J_B94 P241 V1 0 DR
J_A220 N197 N202 0 DR
R394 VDD N197 50k
J_F112 VDD N197 P243 DR
R395 P243 S1 1k
R396 S1 VSS 4.5k
J_A221 N208 U0 P244 DR
R397 VDD N208 100k
J_F113 VDD N208 P245 DR
R398 P245 N218 1k
R399 N218 VSS 4.8k
J_B95 P244 V2 0 DR
J_A222 N213 N218 0 DR
R400 VDD N213 50k
J_F114 VDD N213 P246 DR
R401 P246 S2 1k
R402 S2 VSS 4.5k
J_A223 N222 U0 P247 DR
R403 VDD N222 100k
J_F115 VDD N222 P248 DR
R404 P248 N232 1k
R405 N232 VSS 4.8k
J_B96 P247 V3 0 DR
J_A224 N227 N232 0 DR
R406 VDD N227 50k
J_F116 VDD N227 P249 DR
R407 P249 S3 1k
R408 S3 VSS 4.5k
J_A225 N174 U1 P250 DR
R409 VDD N174 100k
J_F117 VDD N174 P251 DR
R410 P251 N185 1k
R411 N185 VSS 4.8k
J_B97 P250 V0 0 DR
J_A226 N179 N185 0 DR
R412 VDD N179 50k
J_F118 VDD N179 P252 DR
R413 P252 S4 1k
R414 S4 VSS 4.5k
J_A227 N193 U1 P253 DR
R415 VDD N193 100k
J_F119 VDD N193 P254 DR
R416 P254 N203 1k
R417 N203 VSS 4.8k
J_B98 P253 V1 0 DR
J_A228 N198 N203 0 DR
R418 VDD N198 50k
J_F120 VDD N198 P255 DR
R419 P255 S5 1k
R420 S5 VSS 4.5k
J_A229 N209 U1 P256 DR
R421 VDD N209 100k
J_F121 VDD N209 P257 DR
R422 P257 N219 1k
R423 N219 VSS 4.8k
J_B99 P256 V2 0 DR
J_A230 N214 N219 0 DR
R424 VDD N214 50k
J_F122 VDD N214 P258 DR
R425 P258 S6 1k
R426 S6 VSS 4.5k
J_A231 N223 U1 P259 DR
R427 VDD N223 100k
J_F123 VDD N223 P260 DR
R428 P260 N233 1k
R429 N233 VSS 4.8k
J_B100 P259 V3 0 DR
J_A232 N228 N233 0 DR
R430 VDD N228 50k
J_F124 VDD N228 P261 DR
R431 P261 S7 1k
R432 S7 VSS 4.5k
J_A233 N175 U2 P262 DR
R433 VDD N175 100k
J_F125 VDD N175 P263 DR
R434 P263 N186 1k
R435 N186 VSS 4.8k
J_B101 P262 V0 0 DR
J_A234 N180 N186 0 DR
R436 VDD N180 50k
J_F126 VDD N180 P264 DR
R437 P264 S8 1k
R438 S8 VSS 4.5k
J_A235 N194 U2 P265 DR
R439 VDD N194 100k
J_F127 VDD N194 P266 DR
R440 P266 N204 1k
R441 N204 VSS 4.8k
J_B102 P265 V1 0 DR
J_A236 N199 N204 0 DR
R442 VDD N199 50k
J_F128 VDD N199 P267 DR
R443 P267 S9 1k
R444 S9 VSS 4.5k
J_A237 N210 U2 P268 DR
R445 VDD N210 100k
J_F129 VDD N210 P269 DR
R446 P269 N220 1k
R447 N220 VSS 4.8k
J_B103 P268 V2 0 DR
J_A238 N215 N220 0 DR
R448 VDD N215 50k
J_F130 VDD N215 P270 DR
R449 P270 S10 1k
R450 S10 VSS 4.5k
J_A239 N224 U2 P271 DR
R451 VDD N224 100k
J_F131 VDD N224 P272 DR
R452 P272 N234 1k
R453 N234 VSS 4.8k
J_B104 P271 V3 0 DR
J_A240 N229 N234 0 DR
R454 VDD N229 50k
J_F132 VDD N229 P273 DR
R455 P273 S11 1k
R456 S11 VSS 4.5k
J_A241 N176 U3 P274 DR
R457 VDD N176 100k
J_F133 VDD N176 P275 DR
R458 P275 N187 1k
R459 N187 VSS 4.8k
J_B105 P274 V0 0 DR
J_A242 N181 N187 0 DR
R460 VDD N181 50k
J_F134 VDD N181 P276 DR
R461 P276 S12 1k
R462 S12 VSS 4.5k
J_A243 N195 U3 P277 DR
R463 VDD N195 100k
J_F135 VDD N195 P278 DR
R464 P278 N205 1k
R465 N205 VSS 4.8k
J_B106 P277 V1 0 DR
J_A244 N200 N205 0 DR
R466 VDD N200 50k
J_F136 VDD N200 P279 DR
R467 P279 S13 1k
R468 S13 VSS 4.5k
J_A245 N237 M0 P280 DR
R469 VDD N237 100k
J_F137 VDD N237 P281 DR
R470 P281 N240 1k
R471 N240 VSS 4.8k
J_B107 P280 S0 0 DR
J_A246 N239 N240 0 DR
R472 VDD N239 50k
J_F138 VDD N239 P282 DR
R473 P282 NOP 1k
R474 NOP VSS 4.5k
J_A247 N242 M0 P283 DR
R475 VDD N242 100k
J_F139 VDD N242 P284 DR
R476 P284 N247 1k
R477 N247 VSS 4.8k
J_B108 P283 S1 0 DR
J_A248 N244 N247 0 DR
R478 VDD N244 50k
J_F140 VDD N244 P285 DR
R479 P285 WRM 1k
R480 WRM VSS 4.5k
J_A249 N251 M0 P286 DR
R481 VDD N251 100k
J_F141 VDD N251 P287 DR
R482 P287 N255 1k
R483 N255 VSS 4.8k
J_B109 P286 S2 0 DR
J_A250 N253 N255 0 DR
R484 VDD N253 50k
J_F142 VDD N253 P288 DR
R485 P288 RDM 1k
R486 RDM VSS 4.5k
J_A251 N256 M0 P289 DR
R487 VDD N256 100k
J_F143 VDD N256 P290 DR
R488 P290 N258 1k
R489 N258 VSS 4.8k
J_B110 P289 S3 0 DR
J_A252 N257 N258 0 DR
R490 VDD N257 50k
J_F144 VDD N257 P291 DR
R491 P291 CLB 1k
R492 CLB VSS 4.5k
J_A253 N259 M0 P292 DR
R493 VDD N259 100k
J_F145 VDD N259 P293 DR
R494 P293 N261 1k
R495 N261 VSS 4.8k
J_B111 P292 S4 0 DR
J_A254 N260 N261 0 DR
R496 VDD N260 50k
J_F146 VDD N260 P294 DR
R497 P294 CLC 1k
R498 CLC VSS 4.5k
J_A255 N262 M0 P295 DR
R499 VDD N262 100k
J_F147 VDD N262 P296 DR
R500 P296 N264 1k
R501 N264 VSS 4.8k
J_B112 P295 S5 0 DR
J_A256 N263 N264 0 DR
R502 VDD N263 50k
J_F148 VDD N263 P297 DR
R503 P297 IAC 1k
R504 IAC VSS 4.5k
J_A257 N265 M0 P298 DR
R505 VDD N265 100k
J_F149 VDD N265 P299 DR
R506 P299 N267 1k
R507 N267 VSS 4.8k
J_B113 P298 S6 0 DR
J_A258 N266 N267 0 DR
R508 VDD N266 50k
J_F150 VDD N266 P300 DR
R509 P300 CMC 1k
R510 CMC VSS 4.5k
J_A259 N268 M0 P301 DR
R511 VDD N268 100k
J_F151 VDD N268 P302 DR
R512 P302 N270 1k
R513 N270 VSS 4.8k
J_B114 P301 S7 0 DR
J_A260 N269 N270 0 DR
R514 VDD N269 50k
J_F152 VDD N269 P303 DR
R515 P303 CMA 1k
R516 CMA VSS 4.5k
J_A261 N271 M0 P304 DR
R517 VDD N271 100k
J_F153 VDD N271 P305 DR
R518 P305 N273 1k
R519 N273 VSS 4.8k
J_B115 P304 S8 0 DR
J_A262 N272 N273 0 DR
R520 VDD N272 50k
J_F154 VDD N272 P306 DR
R521 P306 RAL 1k
R522 RAL VSS 4.5k
J_A263 N274 M0 P307 DR
R523 VDD N274 100k
J_F155 VDD N274 P308 DR
R524 P308 N276 1k
R525 N276 VSS 4.8k
J_B116 P307 S9 0 DR
J_A264 N275 N276 0 DR
R526 VDD N275 50k
J_F156 VDD N275 P309 DR
R527 P309 RAR 1k
R528 RAR VSS 4.5k
J_A265 N277 M0 P310 DR
R529 VDD N277 100k
J_F157 VDD N277 P311 DR
R530 P311 N279 1k
R531 N279 VSS 4.8k
J_B117 P310 S10 0 DR
J_A266 N278 N279 0 DR
R532 VDD N278 50k
J_F158 VDD N278 P312 DR
R533 P312 TCC 1k
R534 TCC VSS 4.5k
J_A267 N280 M0 P313 DR
R535 VDD N280 100k
J_F159 VDD N280 P314 DR
R536 P314 N282 1k
R537 N282 VSS 4.8k
J_B118 P313 S11 0 DR
J_A268 N281 N282 0 DR
R538 VDD N281 50k
J_F160 VDD N281 P315 DR
R539 P315 DAC 1k
R540 DAC VSS 4.5k
J_A269 N283 M0 P316 DR
R541 VDD N283 100k
J_F161 VDD N283 P317 DR
R542 P317 N285 1k
R543 N285 VSS 4.8k
J_B119 P316 S12 0 DR
J_A270 N284 N285 0 DR
R544 VDD N284 50k
J_F162 VDD N284 P318 DR
R545 P318 TCS 1k
R546 TCS VSS 4.5k
J_A271 N286 M0 P319 DR
R547 VDD N286 100k
J_F163 VDD N286 P320 DR
R548 P320 N288 1k
R549 N288 VSS 4.8k
J_B120 P319 S13 0 DR
J_A272 N287 N288 0 DR
R550 VDD N287 50k
J_F164 VDD N287 P321 DR
R551 P321 STC 1k
R552 STC VSS 4.5k
J_A275 N241 M3 P322 DR
R559 VDD N241 100k
J_F167 VDD N241 P323 DR
R560 P323 N245 1k
R561 N245 VSS 4.8k
J_B122 P322 _IR2_3 0 DR
J_A276 N243 N245 0 DR
R562 VDD N243 50k
J_F168 VDD N243 P324 DR
R563 P324 FIN 1k
R564 FIN VSS 4.5k
J_A277 N250 M3 P325 DR
R565 VDD N250 100k
J_F169 VDD N250 P326 DR
R566 P326 N254 1k
R567 N254 VSS 4.8k
J_B123 P325 IR2_3 0 DR
J_A278 N252 N254 0 DR
R568 VDD N252 50k
J_F170 VDD N252 P327 DR
R569 P327 JIN 1k
R570 JIN VSS 4.5k
J_A273 N236 AZ P328 DR
R49 VDD N236 100k
J_F13 VDD N236 P329 DR
R50 P329 _Condition 1k
R51 _Condition VSS 4.8k
J_B121 P328 IR2_2 0 DR
J_A274 N238 _Condition 0 DR
R553 VDD N238 50k
J_F165 VDD N238 P330 DR
R554 P330 Condition 1k
R555 Condition VSS 4.5k
J_A279 N236 CF P331 DR
J_B124 P331 IR2_1 0 DR
J_A280 N246 Condition P332 DR
R556 VDD N246 100k
J_F166 VDD N246 P333 DR
R557 P333 N249 1k
R558 N249 VSS 4.8k
J_B125 P332 IR2_3 0 DR
J_A281 N248 N249 0 DR
R571 VDD N248 50k
J_F171 VDD N248 P334 DR
R572 P334 Jumping 1k
R573 Jumping VSS 4.5k
J_A282 N246 _Condition P335 DR
J_B126 P335 _IR2_3 0 DR
.model NJF NJF
.model PJF PJF
.lib standard.jft
* Instruction Register 1
* Instruction Register 2
* Instruction Register 3
* Instruction Register 4
* IR1 MUX
* IR2 MUX
.backanno
.end